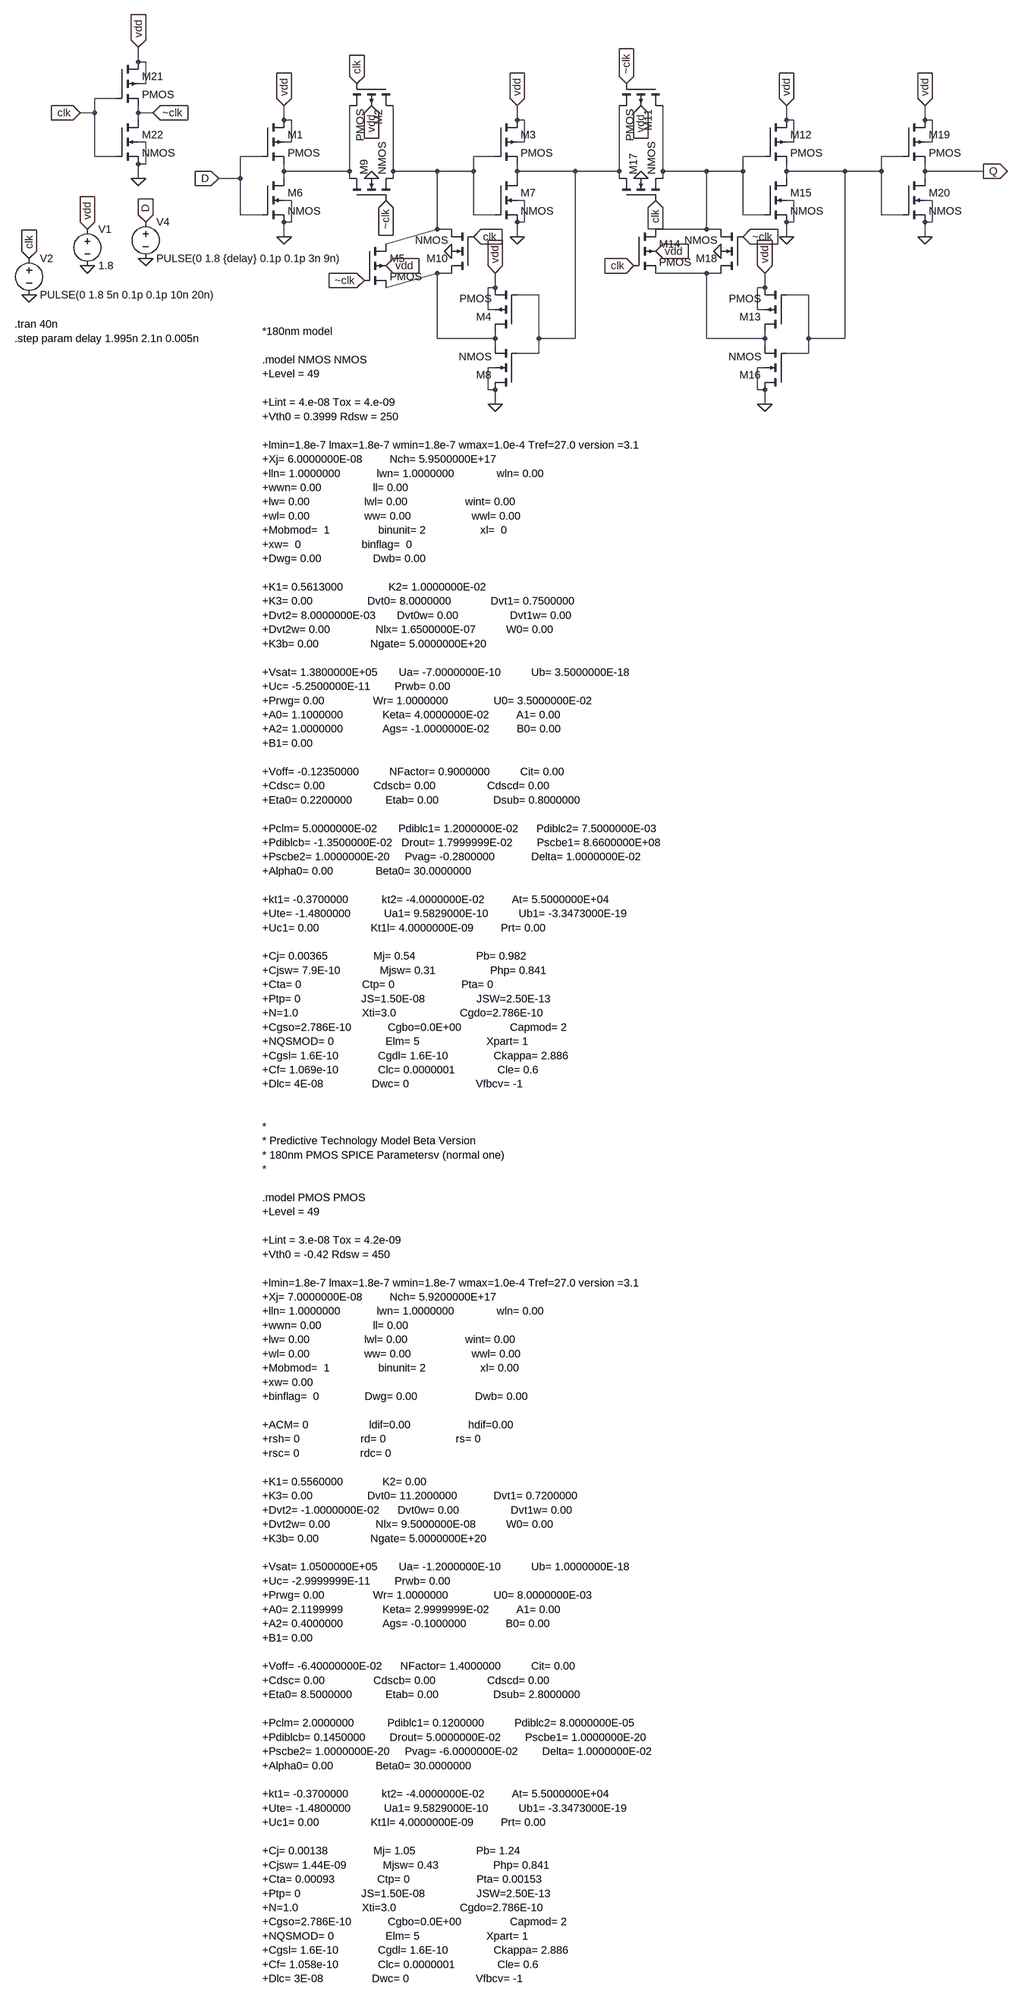
[diagram p0: schematic Msdff.asc]
Msdff.asc, the LTspice schematic file:
Version 4
SHEET 1 880 4692
WIRE -1824 -384 -1824 -416
WIRE -1808 -384 -1824 -384
WIRE -1808 -336 -1808 -384
WIRE -1808 -336 -1824 -336
WIRE -1872 -304 -1920 -304
WIRE -1920 -272 -1920 -304
WIRE -1920 -272 -1952 -272
WIRE -1824 -272 -1824 -288
WIRE -1792 -272 -1824 -272
WIRE -1824 -256 -1824 -272
WIRE -1504 -256 -1504 -288
WIRE -1488 -256 -1504 -256
WIRE -992 -256 -992 -288
WIRE -976 -256 -992 -256
WIRE -400 -256 -400 -288
WIRE -384 -256 -400 -256
WIRE -96 -256 -96 -288
WIRE -80 -256 -96 -256
WIRE -1808 -208 -1824 -208
WIRE -1488 -208 -1488 -256
WIRE -1488 -208 -1504 -208
WIRE -976 -208 -976 -256
WIRE -976 -208 -992 -208
WIRE -384 -208 -384 -256
WIRE -384 -208 -400 -208
WIRE -80 -208 -80 -256
WIRE -80 -208 -96 -208
WIRE -1920 -176 -1920 -272
WIRE -1872 -176 -1920 -176
WIRE -1552 -176 -1600 -176
WIRE -1040 -176 -1088 -176
WIRE -448 -176 -496 -176
WIRE -144 -176 -192 -176
WIRE -1808 -160 -1808 -208
WIRE -1808 -160 -1824 -160
WIRE -1504 -144 -1504 -160
WIRE -1360 -144 -1360 -288
WIRE -1360 -144 -1504 -144
WIRE -1264 -144 -1264 -288
WIRE -1168 -144 -1264 -144
WIRE -1088 -144 -1088 -176
WIRE -1088 -144 -1168 -144
WIRE -992 -144 -992 -160
WIRE -864 -144 -992 -144
WIRE -768 -144 -768 -288
WIRE -768 -144 -864 -144
WIRE -672 -144 -672 -288
WIRE -576 -144 -672 -144
WIRE -496 -144 -496 -176
WIRE -496 -144 -576 -144
WIRE -400 -144 -400 -160
WIRE -272 -144 -400 -144
WIRE -192 -144 -192 -176
WIRE -192 -144 -272 -144
WIRE -96 -144 -96 -160
WIRE 32 -144 -96 -144
WIRE -1824 -128 -1824 -160
WIRE -1600 -128 -1600 -176
WIRE -1600 -128 -1648 -128
WIRE -1504 -128 -1504 -144
WIRE -1360 -128 -1360 -144
WIRE -1264 -128 -1264 -144
WIRE -992 -128 -992 -144
WIRE -768 -128 -768 -144
WIRE -672 -128 -672 -144
WIRE -400 -128 -400 -144
WIRE -96 -128 -96 -144
WIRE -1488 -80 -1504 -80
WIRE -976 -80 -992 -80
WIRE -384 -80 -400 -80
WIRE -80 -80 -96 -80
WIRE -1600 -48 -1600 -128
WIRE -1552 -48 -1600 -48
WIRE -1088 -48 -1088 -144
WIRE -1040 -48 -1088 -48
WIRE -496 -48 -496 -144
WIRE -448 -48 -496 -48
WIRE -192 -48 -192 -144
WIRE -144 -48 -192 -48
WIRE -1488 -32 -1488 -80
WIRE -1488 -32 -1504 -32
WIRE -976 -32 -976 -80
WIRE -976 -32 -992 -32
WIRE -384 -32 -384 -80
WIRE -384 -32 -400 -32
WIRE -80 -32 -80 -80
WIRE -80 -32 -96 -32
WIRE -1168 -16 -1168 -144
WIRE -1136 -16 -1168 -16
WIRE -576 -16 -576 -144
WIRE -576 -16 -688 -16
WIRE -544 -16 -576 -16
WIRE -1504 0 -1504 -32
WIRE -992 0 -992 -32
WIRE -400 0 -400 -32
WIRE -96 0 -96 -32
WIRE -1280 16 -1168 -16
WIRE -1136 80 -1168 80
WIRE -576 80 -688 80
WIRE -544 80 -576 80
WIRE -1280 112 -1168 80
WIRE -1040 112 -1040 80
WIRE -1040 112 -1056 112
WIRE -448 112 -448 80
WIRE -448 112 -464 112
WIRE -944 128 -992 128
WIRE -352 128 -400 128
WIRE -1056 160 -1056 112
WIRE -1040 160 -1056 160
WIRE -464 160 -464 112
WIRE -448 160 -464 160
WIRE -1168 224 -1168 80
WIRE -1040 224 -1040 208
WIRE -1040 224 -1168 224
WIRE -944 224 -944 128
WIRE -864 224 -864 -144
WIRE -864 224 -944 224
WIRE -576 224 -576 80
WIRE -448 224 -448 208
WIRE -448 224 -576 224
WIRE -352 224 -352 128
WIRE -272 224 -272 -144
WIRE -272 224 -352 224
WIRE -1040 240 -1040 224
WIRE -448 240 -448 224
WIRE -944 256 -944 224
WIRE -944 256 -992 256
WIRE -352 256 -352 224
WIRE -352 256 -400 256
WIRE -1040 288 -1056 288
WIRE -448 288 -464 288
WIRE -1056 336 -1056 288
WIRE -1040 336 -1056 336
WIRE -464 336 -464 288
WIRE -448 336 -464 336
WIRE -1040 368 -1040 336
WIRE -448 368 -448 336
FLAG -1648 -128 D
IOPIN -1648 -128 In
FLAG -1504 -288 vdd
IOPIN -1504 -288 In
FLAG -992 -288 vdd
IOPIN -992 -288 In
FLAG -1040 80 vdd
IOPIN -1040 80 In
FLAG -1504 0 0
FLAG -992 0 0
FLAG -1040 368 0
FLAG -1344 -336 clk
IOPIN -1344 -336 In
FLAG -1088 0 clk
IOPIN -1088 0 In
FLAG -1280 -80 ~clk
IOPIN -1280 -80 In
FLAG -1328 96 ~clk
IOPIN -1328 96 In
FLAG -1936 64 0
FLAG -2064 128 0
FLAG -1936 -16 vdd
IOPIN -1936 -16 In
FLAG -2064 48 clk
IOPIN -2064 48 In
FLAG -1808 48 0
FLAG -1808 -32 D
IOPIN -1808 -32 In
FLAG -400 -288 vdd
IOPIN -400 -288 In
FLAG -448 80 vdd
IOPIN -448 80 In
FLAG -400 0 0
FLAG -448 368 0
FLAG -752 -336 ~clk
IOPIN -752 -336 In
FLAG -496 0 ~clk
IOPIN -496 0 In
FLAG -688 -80 clk
IOPIN -688 -80 In
FLAG -736 64 clk
IOPIN -736 64 In
FLAG -96 -288 vdd
IOPIN -96 -288 In
FLAG -96 0 0
FLAG 32 -144 Q
IOPIN 32 -144 Out
FLAG -1824 -416 vdd
IOPIN -1824 -416 In
FLAG -1824 -128 0
FLAG -1952 -272 clk
IOPIN -1952 -272 In
FLAG -1792 -272 ~clk
IOPIN -1792 -272 In
FLAG -1312 -288 vdd
IOPIN -1312 -288 In
FLAG -720 -288 vdd
IOPIN -720 -288 In
FLAG -1280 64 vdd
IOPIN -1280 64 In
FLAG -688 32 vdd
IOPIN -688 32 In
FLAG -1136 32 0
FLAG -1312 -128 0
FLAG -544 32 0
FLAG -720 -128 0
SYMBOL pmos4 -1552 -256 R0
SYMATTR InstName M1
SYMATTR Value2 l=180n w=720n
SYMBOL pmos4 -1264 -336 R90
SYMATTR InstName M2
SYMATTR Value2 l=180n w=720n
SYMBOL pmos4 -1040 -256 R0
SYMATTR InstName M3
SYMATTR Value2 l=180n w=720n
SYMBOL pmos4 -992 208 R180
SYMATTR InstName M4
SYMATTR Value2 l=180n w=720n
SYMBOL pmos4 -1328 16 R0
SYMATTR InstName M5
SYMATTR Value2 l=180n w=720n
SYMBOL nmos4 -1552 -128 R0
SYMATTR InstName M6
SYMATTR Value2 l=180n w=180n
SYMBOL nmos4 -1040 -128 R0
SYMATTR InstName M7
SYMATTR Value2 l=180n w=180n
SYMBOL nmos4 -992 336 R180
SYMATTR InstName M8
SYMATTR Value2 l=180n w=180n
SYMBOL nmos4 -1360 -80 R270
SYMATTR InstName M9
SYMATTR Value2 l=180n w=180n
SYMBOL nmos4 -1088 80 R180
SYMATTR InstName M10
SYMATTR Value2 l=180n w=180n
SYMBOL voltage -1936 -32 R0
WINDOW 123 0 0 Left 0
WINDOW 39 0 0 Left 0
SYMATTR InstName V1
SYMATTR Value 1.8
SYMBOL voltage -2064 32 R0
WINDOW 123 0 0 Left 0
WINDOW 39 0 0 Left 0
SYMATTR InstName V2
SYMATTR Value PULSE(0 1.8 5n 0.1p 0.1p 10n 20n)
SYMBOL voltage -1808 -48 R0
WINDOW 123 0 0 Left 0
WINDOW 39 0 0 Left 0
SYMATTR InstName V4
SYMATTR Value PULSE(0 1.8 {delay} 0.1p 0.1p 3n 9n)
SYMBOL pmos4 -672 -336 R90
SYMATTR InstName M11
SYMATTR Value2 l=180n w=720n
SYMBOL pmos4 -448 -256 R0
SYMATTR InstName M12
SYMATTR Value2 l=180n w=720n
SYMBOL pmos4 -400 208 R180
SYMATTR InstName M13
SYMATTR Value2 l=180n w=720n
SYMBOL pmos4 -736 -16 R0
SYMATTR InstName M14
SYMATTR Value2 l=180n w=720n
SYMBOL nmos4 -448 -128 R0
SYMATTR InstName M15
SYMATTR Value2 l=180n w=180n
SYMBOL nmos4 -400 336 R180
SYMATTR InstName M16
SYMATTR Value2 l=180n w=180n
SYMBOL nmos4 -768 -80 R270
SYMATTR InstName M17
SYMATTR Value2 l=180n w=180n
SYMBOL nmos4 -496 80 R180
SYMATTR InstName M18
SYMATTR Value2 l=180n w=180n
SYMBOL pmos4 -144 -256 R0
SYMATTR InstName M19
SYMATTR Value2 l=180n w=720n
SYMBOL nmos4 -144 -128 R0
SYMATTR InstName M20
SYMATTR Value2 l=180n w=180n
SYMBOL pmos4 -1872 -384 R0
SYMATTR InstName M21
SYMATTR Value2 l=180n w=720n
SYMBOL nmos4 -1872 -256 R0
SYMATTR InstName M22
SYMATTR Value2 l=180n w=180n
TEXT -2096 192 Left 2 !.tran 40n
TEXT -1552 208 Left 2 !*180nm model\n \n.model NMOS NMOS\n+Level = 49\n \n+Lint = 4.e-08 Tox = 4.e-09 \n+Vth0 = 0.3999 Rdsw = 250 \n \n+lmin=1.8e-7 lmax=1.8e-7 wmin=1.8e-7 wmax=1.0e-4 Tref=27.0 version =3.1\n+Xj= 6.0000000E-08         Nch= 5.9500000E+17 \n+lln= 1.0000000            lwn= 1.0000000              wln= 0.00\n+wwn= 0.00                 ll= 0.00\n+lw= 0.00                  lwl= 0.00                   wint= 0.00\n+wl= 0.00                  ww= 0.00                    wwl= 0.00\n+Mobmod=  1                binunit= 2                  xl=  0\n+xw=  0                    binflag=  0\n+Dwg= 0.00                 Dwb= 0.00 \n \n+K1= 0.5613000               K2= 1.0000000E-02 \n+K3= 0.00                  Dvt0= 8.0000000             Dvt1= 0.7500000 \n+Dvt2= 8.0000000E-03       Dvt0w= 0.00                 Dvt1w= 0.00 \n+Dvt2w= 0.00               Nlx= 1.6500000E-07          W0= 0.00 \n+K3b= 0.00                 Ngate= 5.0000000E+20 \n \n+Vsat= 1.3800000E+05       Ua= -7.0000000E-10          Ub= 3.5000000E-18 \n+Uc= -5.2500000E-11        Prwb= 0.00 \n+Prwg= 0.00                Wr= 1.0000000               U0= 3.5000000E-02 \n+A0= 1.1000000             Keta= 4.0000000E-02         A1= 0.00 \n+A2= 1.0000000             Ags= -1.0000000E-02         B0= 0.00 \n+B1= 0.00 \n \n+Voff= -0.12350000          NFactor= 0.9000000          Cit= 0.00 \n+Cdsc= 0.00                Cdscb= 0.00                 Cdscd= 0.00 \n+Eta0= 0.2200000           Etab= 0.00                  Dsub= 0.8000000 \n \n+Pclm= 5.0000000E-02       Pdiblc1= 1.2000000E-02      Pdiblc2= 7.5000000E-03 \n+Pdiblcb= -1.3500000E-02   Drout= 1.7999999E-02        Pscbe1= 8.6600000E+08 \n+Pscbe2= 1.0000000E-20     Pvag= -0.2800000            Delta= 1.0000000E-02 \n+Alpha0= 0.00              Beta0= 30.0000000 \n \n+kt1= -0.3700000           kt2= -4.0000000E-02         At= 5.5000000E+04 \n+Ute= -1.4800000           Ua1= 9.5829000E-10          Ub1= -3.3473000E-19 \n+Uc1= 0.00                 Kt1l= 4.0000000E-09         Prt= 0.00 \n \n+Cj= 0.00365               Mj= 0.54                    Pb= 0.982\n+Cjsw= 7.9E-10             Mjsw= 0.31                  Php= 0.841\n+Cta= 0                    Ctp= 0                      Pta= 0\n+Ptp= 0                    JS=1.50E-08                 JSW=2.50E-13\n+N=1.0                     Xti=3.0                     Cgdo=2.786E-10\n+Cgso=2.786E-10            Cgbo=0.0E+00                Capmod= 2\n+NQSMOD= 0                 Elm= 5                      Xpart= 1\n+Cgsl= 1.6E-10             Cgdl= 1.6E-10               Ckappa= 2.886\n+Cf= 1.069e-10             Clc= 0.0000001              Cle= 0.6\n+Dlc= 4E-08                Dwc= 0                      Vfbcv= -1\n \n \n*\n* Predictive Technology Model Beta Version\n* 180nm PMOS SPICE Parametersv (normal one)\n*\n \n.model PMOS PMOS\n+Level = 49\n \n+Lint = 3.e-08 Tox = 4.2e-09 \n+Vth0 = -0.42 Rdsw = 450 \n \n+lmin=1.8e-7 lmax=1.8e-7 wmin=1.8e-7 wmax=1.0e-4 Tref=27.0 version =3.1\n+Xj= 7.0000000E-08         Nch= 5.9200000E+17 \n+lln= 1.0000000            lwn= 1.0000000              wln= 0.00\n+wwn= 0.00                 ll= 0.00\n+lw= 0.00                  lwl= 0.00                   wint= 0.00\n+wl= 0.00                  ww= 0.00                    wwl= 0.00\n+Mobmod=  1                binunit= 2                  xl= 0.00\n+xw= 0.00                  \n+binflag=  0               Dwg= 0.00                   Dwb= 0.00 \n \n+ACM= 0                    ldif=0.00                   hdif=0.00\n+rsh= 0                    rd= 0                       rs= 0\n+rsc= 0                    rdc= 0\n \n+K1= 0.5560000             K2= 0.00 \n+K3= 0.00                  Dvt0= 11.2000000            Dvt1= 0.7200000 \n+Dvt2= -1.0000000E-02      Dvt0w= 0.00                 Dvt1w= 0.00 \n+Dvt2w= 0.00               Nlx= 9.5000000E-08          W0= 0.00 \n+K3b= 0.00                 Ngate= 5.0000000E+20 \n \n+Vsat= 1.0500000E+05       Ua= -1.2000000E-10          Ub= 1.0000000E-18 \n+Uc= -2.9999999E-11        Prwb= 0.00 \n+Prwg= 0.00                Wr= 1.0000000               U0= 8.0000000E-03 \n+A0= 2.1199999             Keta= 2.9999999E-02         A1= 0.00 \n+A2= 0.4000000             Ags= -0.1000000             B0= 0.00 \n+B1= 0.00 \n \n+Voff= -6.40000000E-02      NFactor= 1.4000000          Cit= 0.00 \n+Cdsc= 0.00                Cdscb= 0.00                 Cdscd= 0.00 \n+Eta0= 8.5000000           Etab= 0.00                  Dsub= 2.8000000 \n \n+Pclm= 2.0000000           Pdiblc1= 0.1200000          Pdiblc2= 8.0000000E-05 \n+Pdiblcb= 0.1450000        Drout= 5.0000000E-02        Pscbe1= 1.0000000E-20 \n+Pscbe2= 1.0000000E-20     Pvag= -6.0000000E-02        Delta= 1.0000000E-02 \n+Alpha0= 0.00              Beta0= 30.0000000 \n \n+kt1= -0.3700000           kt2= -4.0000000E-02         At= 5.5000000E+04 \n+Ute= -1.4800000           Ua1= 9.5829000E-10          Ub1= -3.3473000E-19 \n+Uc1= 0.00                 Kt1l= 4.0000000E-09         Prt= 0.00 \n \n+Cj= 0.00138               Mj= 1.05                    Pb= 1.24\n+Cjsw= 1.44E-09            Mjsw= 0.43                  Php= 0.841\n+Cta= 0.00093              Ctp= 0                      Pta= 0.00153\n+Ptp= 0                    JS=1.50E-08                 JSW=2.50E-13\n+N=1.0                     Xti=3.0                     Cgdo=2.786E-10\n+Cgso=2.786E-10            Cgbo=0.0E+00                Capmod= 2\n+NQSMOD= 0                 Elm= 5                      Xpart= 1\n+Cgsl= 1.6E-10             Cgdl= 1.6E-10               Ckappa= 2.886\n+Cf= 1.058e-10             Clc= 0.0000001              Cle= 0.6\n+Dlc= 3E-08                Dwc= 0                      Vfbcv= -1
TEXT -2096 224 Left 2 !.step param delay 1.995n 2.1n 0.005n

The netlist it stands for:
* Msdff.asc
M1 vdd D N004 vdd PMOS l=180n w=720n
M2 N001 clk N004 vdd PMOS l=180n w=720n
M3 vdd N001 N005 vdd PMOS l=180n w=720n
M4 N006 N005 vdd vdd PMOS l=180n w=720n
M5 N001 ~clk N006 vdd PMOS l=180n w=720n
M6 N004 D 0 0 NMOS l=180n w=180n
M7 N005 N001 0 0 NMOS l=180n w=180n
M8 0 N005 N006 0 NMOS l=180n w=180n
M9 N004 ~clk N001 0 NMOS l=180n w=180n
M10 N006 clk N001 0 NMOS l=180n w=180n
V1 vdd 0 1.8
V2 clk 0 PULSE(0 1.8 5n 0.1p 0.1p 10n 20n)
V4 D 0 PULSE(0 1.8 {delay} 0.1p 0.1p 3n 9n)
M11 N002 ~clk N005 vdd PMOS l=180n w=720n
M12 vdd N002 N003 vdd PMOS l=180n w=720n
M13 N007 N003 vdd vdd PMOS l=180n w=720n
M14 N002 clk N007 vdd PMOS l=180n w=720n
M15 N003 N002 0 0 NMOS l=180n w=180n
M16 0 N003 N007 0 NMOS l=180n w=180n
M17 N005 clk N002 0 NMOS l=180n w=180n
M18 N007 ~clk N002 0 NMOS l=180n w=180n
M19 vdd N003 Q vdd PMOS l=180n w=720n
M20 Q N003 0 0 NMOS l=180n w=180n
M21 vdd clk ~clk vdd PMOS l=180n w=720n
M22 ~clk clk 0 0 NMOS l=180n w=180n
.model NMOS NMOS
.model PMOS PMOS
.lib standard.mos
.tran 40n
*180nm model
.model NMOS NMOS
+Level = 49
+Lint = 4.e-08 Tox = 4.e-09
+Vth0 = 0.3999 Rdsw = 250
+lmin=1.8e-7 lmax=1.8e-7 wmin=1.8e-7 wmax=1.0e-4 Tref=27.0 version =3.1
+Xj= 6.0000000E-08         Nch= 5.9500000E+17
+lln= 1.0000000            lwn= 1.0000000              wln= 0.00
+wwn= 0.00                 ll= 0.00
+lw= 0.00                  lwl= 0.00                   wint= 0.00
+wl= 0.00                  ww= 0.00                    wwl= 0.00
+Mobmod=  1                binunit= 2                  xl=  0
+xw=  0                    binflag=  0
+Dwg= 0.00                 Dwb= 0.00
+K1= 0.5613000               K2= 1.0000000E-02
+K3= 0.00                  Dvt0= 8.0000000             Dvt1= 0.7500000
+Dvt2= 8.0000000E-03       Dvt0w= 0.00                 Dvt1w= 0.00
+Dvt2w= 0.00               Nlx= 1.6500000E-07          W0= 0.00
+K3b= 0.00                 Ngate= 5.0000000E+20
+Vsat= 1.3800000E+05       Ua= -7.0000000E-10          Ub= 3.5000000E-18
+Uc= -5.2500000E-11        Prwb= 0.00
+Prwg= 0.00                Wr= 1.0000000               U0= 3.5000000E-02
+A0= 1.1000000             Keta= 4.0000000E-02         A1= 0.00
+A2= 1.0000000             Ags= -1.0000000E-02         B0= 0.00
+B1= 0.00
+Voff= -0.12350000          NFactor= 0.9000000          Cit= 0.00
+Cdsc= 0.00                Cdscb= 0.00                 Cdscd= 0.00
+Eta0= 0.2200000           Etab= 0.00                  Dsub= 0.8000000
+Pclm= 5.0000000E-02       Pdiblc1= 1.2000000E-02      Pdiblc2= 7.5000000E-03
+Pdiblcb= -1.3500000E-02   Drout= 1.7999999E-02        Pscbe1= 8.6600000E+08
+Pscbe2= 1.0000000E-20     Pvag= -0.2800000            Delta= 1.0000000E-02
+Alpha0= 0.00              Beta0= 30.0000000
+kt1= -0.3700000           kt2= -4.0000000E-02         At= 5.5000000E+04
+Ute= -1.4800000           Ua1= 9.5829000E-10          Ub1= -3.3473000E-19
+Uc1= 0.00                 Kt1l= 4.0000000E-09         Prt= 0.00
+Cj= 0.00365               Mj= 0.54                    Pb= 0.982
+Cjsw= 7.9E-10             Mjsw= 0.31                  Php= 0.841
+Cta= 0                    Ctp= 0                      Pta= 0
+Ptp= 0                    JS=1.50E-08                 JSW=2.50E-13
+N=1.0                     Xti=3.0                     Cgdo=2.786E-10
+Cgso=2.786E-10            Cgbo=0.0E+00                Capmod= 2
+NQSMOD= 0                 Elm= 5                      Xpart= 1
+Cgsl= 1.6E-10             Cgdl= 1.6E-10               Ckappa= 2.886
+Cf= 1.069e-10             Clc= 0.0000001              Cle= 0.6
+Dlc= 4E-08                Dwc= 0                      Vfbcv= -1
*
* Predictive Technology Model Beta Version
* 180nm PMOS SPICE Parametersv (normal one)
*
.model PMOS PMOS
+Level = 49
+Lint = 3.e-08 Tox = 4.2e-09
+Vth0 = -0.42 Rdsw = 450
+lmin=1.8e-7 lmax=1.8e-7 wmin=1.8e-7 wmax=1.0e-4 Tref=27.0 version =3.1
+Xj= 7.0000000E-08         Nch= 5.9200000E+17
+lln= 1.0000000            lwn= 1.0000000              wln= 0.00
+wwn= 0.00                 ll= 0.00
+lw= 0.00                  lwl= 0.00                   wint= 0.00
+wl= 0.00                  ww= 0.00                    wwl= 0.00
+Mobmod=  1                binunit= 2                  xl= 0.00
+xw= 0.00
+binflag=  0               Dwg= 0.00                   Dwb= 0.00
+ACM= 0                    ldif=0.00                   hdif=0.00
+rsh= 0                    rd= 0                       rs= 0
+rsc= 0                    rdc= 0
+K1= 0.5560000             K2= 0.00
+K3= 0.00                  Dvt0= 11.2000000            Dvt1= 0.7200000
+Dvt2= -1.0000000E-02      Dvt0w= 0.00                 Dvt1w= 0.00
+Dvt2w= 0.00               Nlx= 9.5000000E-08          W0= 0.00
+K3b= 0.00                 Ngate= 5.0000000E+20
+Vsat= 1.0500000E+05       Ua= -1.2000000E-10          Ub= 1.0000000E-18
+Uc= -2.9999999E-11        Prwb= 0.00
+Prwg= 0.00                Wr= 1.0000000               U0= 8.0000000E-03
+A0= 2.1199999             Keta= 2.9999999E-02         A1= 0.00
+A2= 0.4000000             Ags= -0.1000000             B0= 0.00
+B1= 0.00
+Voff= -6.40000000E-02      NFactor= 1.4000000          Cit= 0.00
+Cdsc= 0.00                Cdscb= 0.00                 Cdscd= 0.00
+Eta0= 8.5000000           Etab= 0.00                  Dsub= 2.8000000
+Pclm= 2.0000000           Pdiblc1= 0.1200000          Pdiblc2= 8.0000000E-05
+Pdiblcb= 0.1450000        Drout= 5.0000000E-02        Pscbe1= 1.0000000E-20
+Pscbe2= 1.0000000E-20     Pvag= -6.0000000E-02        Delta= 1.0000000E-02
+Alpha0= 0.00              Beta0= 30.0000000
+kt1= -0.3700000           kt2= -4.0000000E-02         At= 5.5000000E+04
+Ute= -1.4800000           Ua1= 9.5829000E-10          Ub1= -3.3473000E-19
+Uc1= 0.00                 Kt1l= 4.0000000E-09         Prt= 0.00
+Cj= 0.00138               Mj= 1.05                    Pb= 1.24
+Cjsw= 1.44E-09            Mjsw= 0.43                  Php= 0.841
+Cta= 0.00093              Ctp= 0                      Pta= 0.00153
+Ptp= 0                    JS=1.50E-08                 JSW=2.50E-13
+N=1.0                     Xti=3.0                     Cgdo=2.786E-10
+Cgso=2.786E-10            Cgbo=0.0E+00                Capmod= 2
+NQSMOD= 0                 Elm= 5                      Xpart= 1
+Cgsl= 1.6E-10             Cgdl= 1.6E-10               Ckappa= 2.886
+Cf= 1.058e-10             Clc= 0.0000001              Cle= 0.6
+Dlc= 3E-08                Dwc= 0                      Vfbcv= -1
.step param delay 1.995n 2.1n 0.005n
.backanno
.end